# Altium schematic sheet ethernet.SchDoc
size A3; SheetNumber: 8; SheetTotal: 21
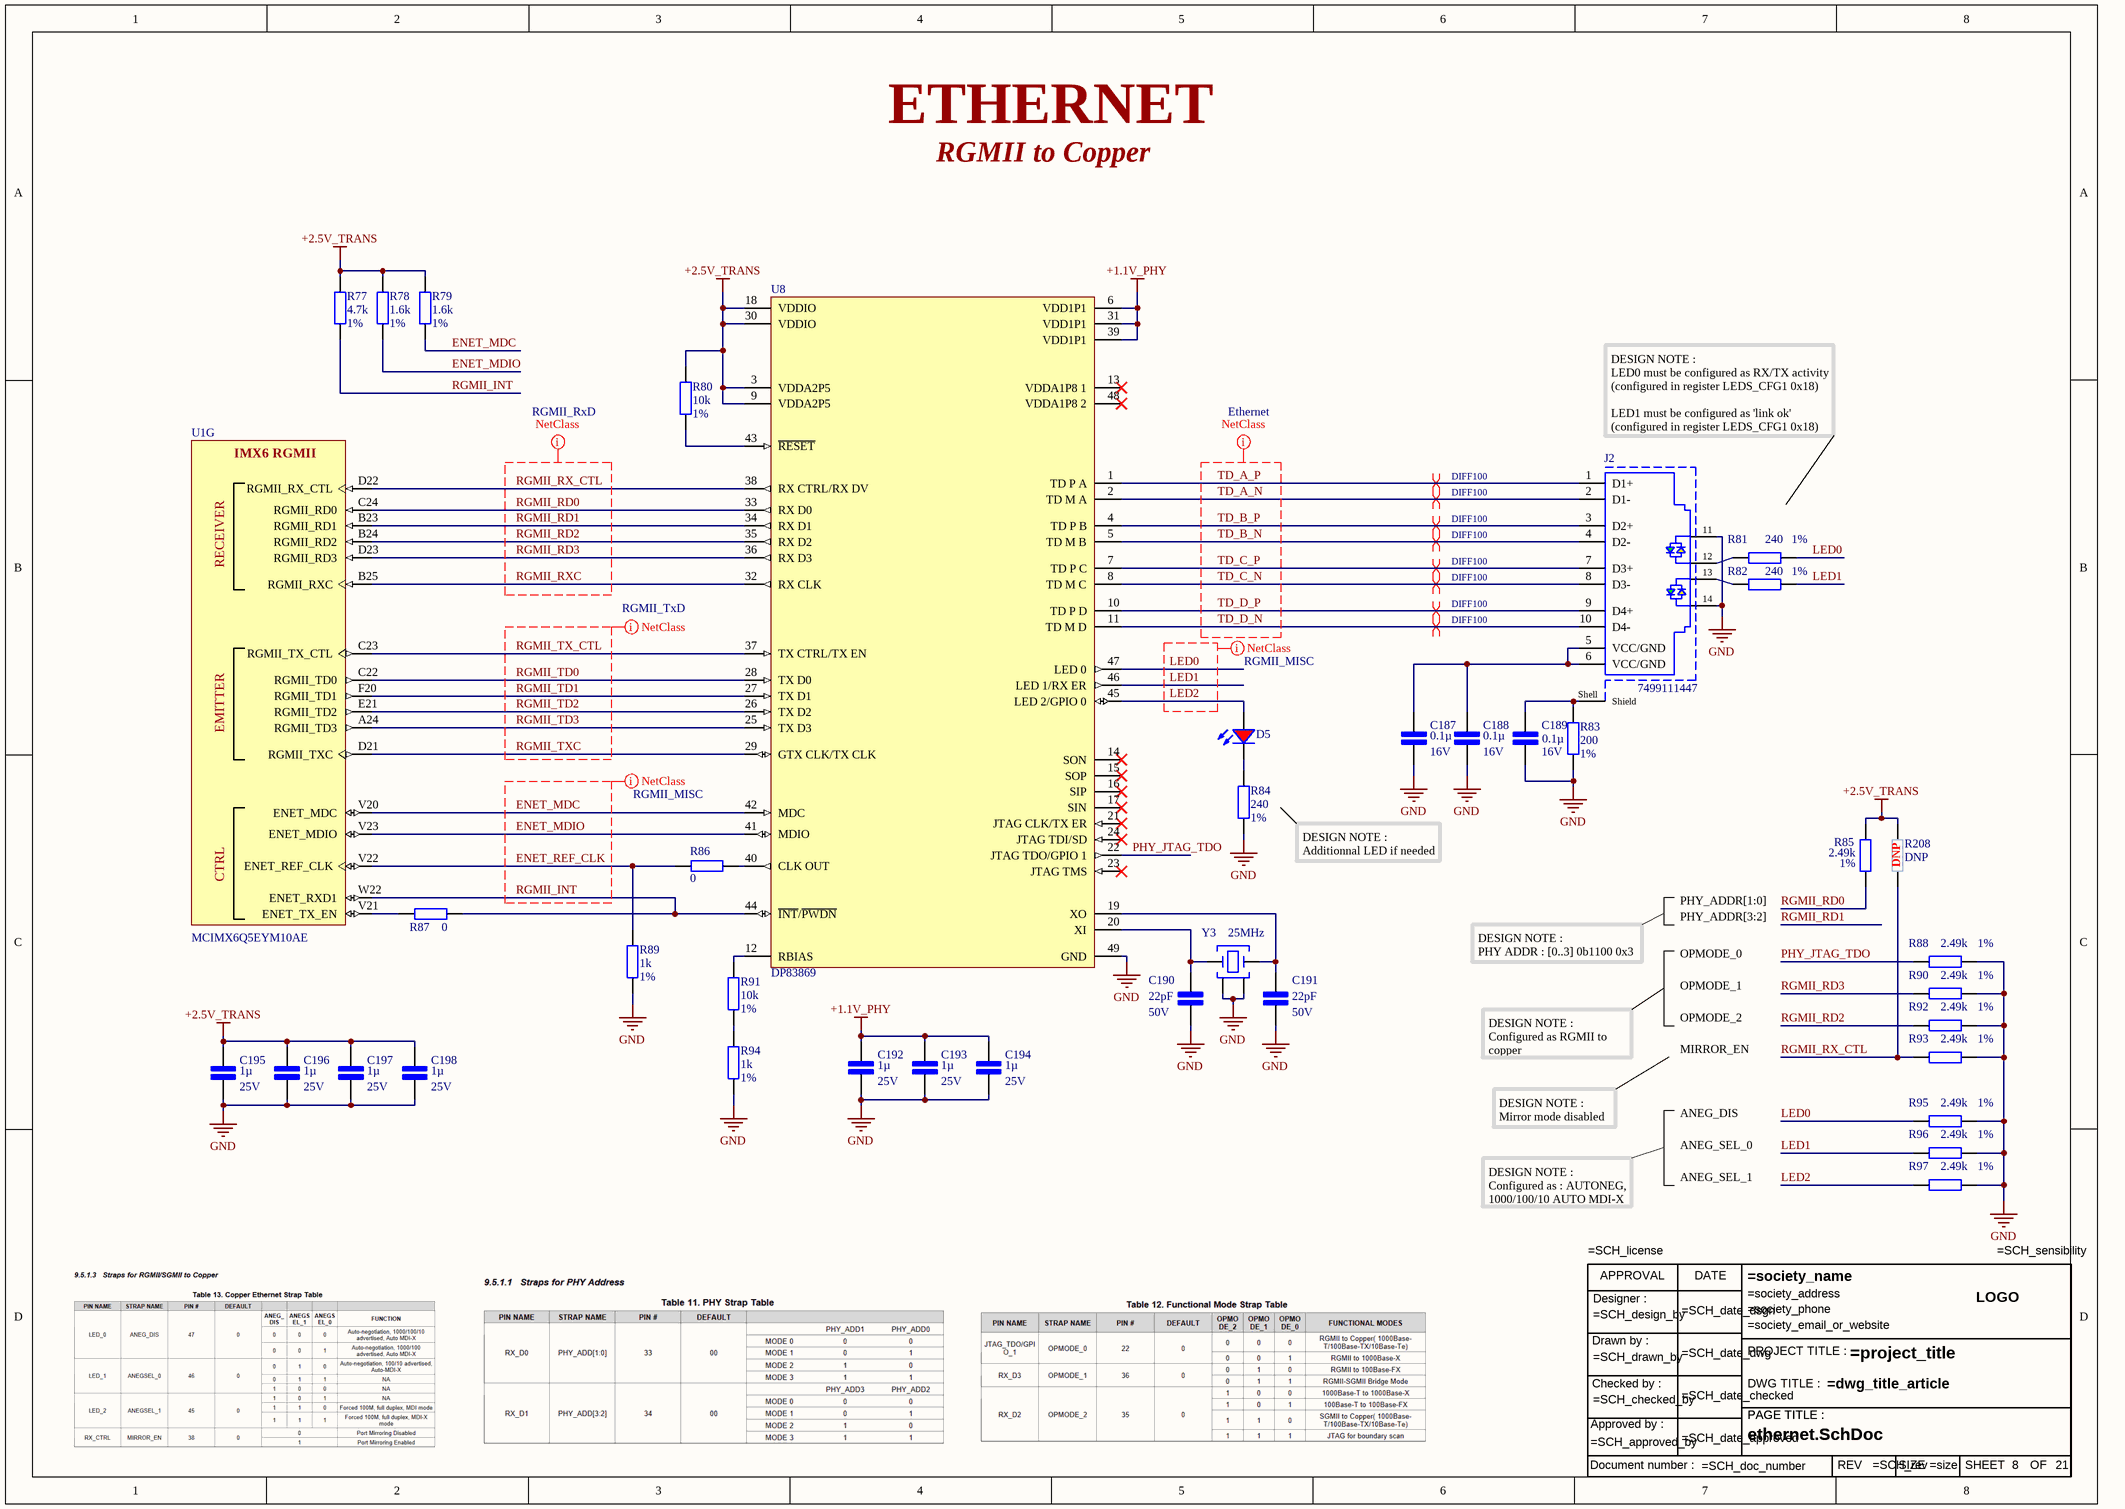
[diagram p0: ethernet.SchDoc]

## Parts
C187  0.1µ  Tension du diélectrique: 16V  [Cap cer 0402/1005]
C188  0.1µ  Tension du diélectrique: 16V  [Cap cer 0402/1005]
C189  0.1µ  Tension du diélectrique: 16V  [Cap cer 0402/1005]
C190  22pF  Tension du diélectrique: 50V  [Cap cer 0402/1005]
C191  22pF  Tension du diélectrique: 50V  [Cap cer 0402/1005]
C192  1µ  Tension du diélectrique: 25V  [Cap cer 0402/1005]
C193  1µ  Tension du diélectrique: 25V  [Cap cer 0402/1005]
C194  1µ  Tension du diélectrique: 25V  [Cap cer 0402/1005]
C195  1µ  Tension du diélectrique: 25V  [Cap cer 0402/1005]
C196  1µ  Tension du diélectrique: 25V  [Cap cer 0402/1005]
C197  1µ  Tension du diélectrique: 25V  [Cap cer 0402/1005]
C198  1µ  Tension du diélectrique: 25V  [Cap cer 0402/1005]
D5  Red, 2V, 120deg  [LED red 0603]  (value not drawn)
J2  7499111447  [RJ45 7499111447]
R77  4.7k  pourcentage: 1%  [Res 0402/1005]
R78  1.6k  pourcentage: 1%  [Res 0402/1005]
R79  1.6k  pourcentage: 1%  [Res 0402/1005]
R80  10k  pourcentage: 1%  [Res 0402/1005]
R81  240  pourcentage: 1%  [Res 0402/1005]
R82  240  pourcentage: 1%  [Res 0402/1005]
R83  200  pourcentage: 1%  [Res 0402/1005]
R84  240  pourcentage: 1%  [Res 0402/1005]
R85  2.49k  pourcentage: 1%  [Res 0402/1005]
R86  0  [Res 0402/1005]
R87  0  [Res 0402/1005]
R88  2.49k  pourcentage: 1%  [Res 0402/1005]
R89  1k  pourcentage: 1%  [Res 0402/1005]
R90  2.49k  pourcentage: 1%  [Res 0402/1005]
R91  10k  pourcentage: 1%  [Res 0402/1005]
R92  2.49k  pourcentage: 1%  [Res 0402/1005]
R93  2.49k  pourcentage: 1%  [Res 0402/1005]
R94  1k  pourcentage: 1%  [Res 0402/1005]
R95  2.49k  pourcentage: 1%  [Res 0402/1005]
R96  2.49k  pourcentage: 1%  [Res 0402/1005]
R97  2.49k  pourcentage: 1%  [Res 0402/1005]
R208  DNP  [Res 0402/1005]
TB7  Title bloc ANSI modified  (value not drawn)
U1  MCIMX6Q5EYM10AE  [FRES-2197-01]  (part G of 21)
U8  DP83869  [QFN48]
Y3  25MHz  [IQXC-42]

## Nets
+1.1V_PHY: C192.1 C193.1 C194.1 U8.6(VDD1P1) U8.31(VDD1P1) U8.39(VDD1P1)
+2.5V_TRANS: C195.1 C196.1 C197.1 C198.1 R77.2 R78.2 R79.2 R80.2 R85.2 R208.2 U8.3(VDDA2P5) U8.9(VDDA2P5) U8.18(VDDIO) U8.30(VDDIO)
GND: C187.2 C188.2 C189.2 C190.2 C191.2 C192.2 C193.2 C194.2 C195.2 C196.2 C197.2 C198.2 J2.11 J2.14 R83.1 R84.1 R88.1 R89.1 R90.1 R92.1 R93.1 R94.1 R95.1 R96.1 R97.1 U8.49(GND) Y3.2(GND) Y3.4(GND)
ENET_MDC: R79.1 U1.V20(ENET_MDC) U8.42(MDC)
ENET_MDIO: R78.1 U1.V23(ENET_MDIO) U8.41(MDIO)
ENET_REF_CLK: R86.1 R89.2 U1.V22(ENET_REF_CLK)
LED0: R81.2 R95.2 U8.47(LED_0)
LED1: R82.2 R96.2 U8.46(LED_1/RX_ER)
LED2: D5.2(A) R97.2 U8.45(LED_2/GPIO_0)
PHY_JTAG_TDO: R88.2 U8.22(JTAG_TDO/GPIO_1)
RGMII_INT: R77.1 R87.2 U1.W22(ENET_RXD1) U8.44(~{INT}/~{PWDN})
RGMII_RD0: R85.1 U1.C24(RGMII_RD0) U8.33(RX_D0)
RGMII_RD1: U1.B23(RGMII_RD1) U8.34(RX_D1)
RGMII_RD2: R92.2 U1.B24(RGMII_RD2) U8.35(RX_D2)
RGMII_RD3: R90.2 U1.D23(RGMII_RD3) U8.36(RX_D3)
RGMII_RX_CTL: R93.2 R208.1 U1.D22(RGMII_RX_CTL) U8.38(RX_CTRL/RX_DV)
RGMII_RXC: U1.B25(RGMII_RXC) U8.32(RX_CLK)
RGMII_TD0: U1.C22(RGMII_TD0) U8.28(TX_D0)
RGMII_TD1: U1.F20(RGMII_TD1) U8.27(TX_D1)
RGMII_TD2: U1.E21(RGMII_TD2) U8.26(TX_D2)
RGMII_TD3: U1.A24(RGMII_TD3) U8.25(TX_D3)
RGMII_TX_CTL: U1.C23(RGMII_TX_CTL) U8.37(TX_CTRL/TX_EN)
RGMII_TXC: U1.D21(RGMII_TXC) U8.29(GTX_CLK/TX_CLK)
TD_A_N: J2.2(D1-) U8.2(TD_M_A)
TD_A_P: J2.1(D1+) U8.1(TD_P_A)
TD_B_N: J2.4(D2-) U8.5(TD_M_B)
TD_B_P: J2.3(D2+) U8.4(TD_P_B)
TD_C_N: J2.8(D3-) U8.8(TD_M_C)
TD_C_P: J2.7(D3+) U8.7(TD_P_C)
TD_D_N: J2.10(D4-) U8.11(TD_M_D)
TD_D_P: J2.9(D4+) U8.10(TD_P_D)
NetC187_1: C187.1 C188.1 J2.5(VCC/GND) J2.6(VCC/GND)
NetC189_1: C189.1 J2.Shell(Shield) R83.2
NetC190_1: C190.1 U8.20(XI) Y3.1(Crystal)
NetC191_1: C191.1 U8.19(XO) Y3.3(Crystal)
NetD5_1: D5.1(K) R84.2
NetJ2_12: J2.12 R81.1
NetJ2_13: J2.13 R82.1
NetR80_1: R80.1 U8.43(~{RESET})
NetR86_2: R86.2 U8.40(CLK_OUT)
NetR87_1: R87.1 U1.V21(ENET_TX_EN)
NetR91_1: R91.1 R94.2
NetR91_2: R91.2 U8.12(RBIAS)

Not connected (* = marked no-connect by the designer): U8 13(VDDA1P8_1)* 14(SON)* 15(SOP)* 16(SIP)* 17(SIN)* 21(JTAG_CLK/TX_ER)* 23(JTAG_TMS)* 24(JTAG_TDI/SD)* 48(VDDA1P8_2)*

## Layout directives
net class Ethernet: TD_A_N, TD_A_P, TD_B_N, TD_B_P, TD_C_N, TD_C_P, TD_D_N, TD_D_P
net class RGMII_RxD: RGMII_RD0, RGMII_RD1, RGMII_RD2, RGMII_RD3, RGMII_RX_CTL, RGMII_RXC
differential pair; differential pair class DIFF100: TD_A_N, TD_A_P, TD_B_N, TD_B_P, TD_C_N, TD_C_P, TD_D_N, TD_D_P
net class RGMII_TxD: RGMII_TD0, RGMII_TD1, RGMII_TD2, RGMII_TD3, RGMII_TX_CTL, RGMII_TXC
net class RGMII_MISC: ENET_MDC, ENET_MDIO, ENET_REF_CLK, LED0, LED1, LED2, RGMII_INT

## Notes on the sheet
- ETHERNET
- RGMII to Copper
- (near J2) DESIGN NOTE :
  LED0 must be configured as RX/TX activity (configured in register LEDS_CFG1 0x18)
  LED1 must be configured as 'link ok' (configured in register LEDS_CFG1 0x18)
- DESIGN NOTE :
  Additionnal LED if needed
- PHY_ADDR[1:0]
- PHY_ADDR[3:2]
- DESIGN NOTE :
  PHY ADDR : [0..3] 0b1100 0x3
- OPMODE_0
- OPMODE_1
- DESIGN NOTE :
  Configured as RGMII to copper
- OPMODE_2
- MIRROR_EN
- DESIGN NOTE :
  Mirror mode disabled
- ANEG_DIS
- ANEG_SEL_0
- ANEG_SEL_1
- DESIGN NOTE :
  Configured as : AUTONEG, 1000/100/10 AUTO MDI-X
- (in symbol IMX6Q5EYM10AE, part G) IMX6 RGMII; RECEIVER; EMITTER; CTRL
- (in symbol Title bloc ANSI) APPROVAL; DATE; Designer :; LOGO; Drawn by :; PROJECT TITLE :; Checked by :; DWG TITLE :; PAGE TITLE :; Approved by :; Document number :; REV; SIZE; SHEET; OF

## Library data of the parts
C187-C189 = cap 0.1µ 16V: cap solid electrolyte 0.1µ 6.3V 10%; Diélectrique: X7R
C190 C191 = cap 22pF 50V: cap cer 22pF 50V 5% NP0 0402; Diélectrique: NP0
C192-C198 = cap 1µ 25V: cap cer 1µ 25V 10% X5R 0402; Diélectrique: X5R
D5 = LED Red 0603: WL-SMCC SMD Mono-color Chip LED Compact, size 0603, Red, 2V, 120deg 150060RS73220; Dominant Wavelength: 624nm; Luminous Intensity: 90mcd; Peak Wavelength: 632nm; Chip Technology: AlInGaP; ComponentLink1URL: http://www.we-online.de; ComponentLink2Description: Datasheet; ComponentLink2URL: https://katalog.we-online.com/led/datasheet/150060RS73220.pdf; Part Number: 150060RS73220; Published Date: July 2019; Publisher: Wurth Elektronik; Size: 0603; Viewing Angle: 120deg; Packaging: Tape and Reel; Emitting Color: Red; Mounting Technology: SMT; Forward Voltage: 2V; Operating Temperature: -40 to +85degC
J2 = RJ45 7499111447
R77 = res 4.7k 1%: res 4.7k 1% 0402
R78 R79 = res 1.6k 1%: res 1.6k 1% 0402
R80 R91 = res 10k 1%: res 10k 1% 0402
R81 R82 R84 = res 240 1%: res 240 1% 0402
R83 = res 200 1%: res 200 1% 0402
R85 R88 R90 R92 R93 R95-R97 = res 2.49k 1%: res 2.49k 1% 0402
R86 R87 = res 0Ohm small: res 0402; pourcentage: --
R89 R94 = res 1k 1%: res 1k 1% 0402
R208 = res DNP 0402: res DNP 0403; pourcentage: 1%
TB7 = Title bloc ANSI
U1 = IMX6Q5EYM10AE: 32-Bit i.MX 6 Quad Application Processor, 1 GHz, 256 KB RAM, Extended Consumer Grade, 624-Pin FCPBGA, RoHS, Tape and Reel; PartNumber: MCIMX6Q5EYM10ACR; Manufacturer: Freescale Semiconductor; CAN: FlexCAN; Number of Cores: 4 Spec; External Memory Supported: DDR3, DDR3L, FLASH, LPDDR2; Speed Grade: 1 GHz; Core Type: ARM Cortex A9; Cache (KB): 32; Ethernet: 1 Gbps + IEEE 1588; Internal RAM (KB): 256; ComponentLink1Description: Manufacturer URL; ComponentLink2Description: Datasheet; DatasheetVersion: Rev. 2.3; ComponentLink3URL: http://cache.freescale.com/files/32bit/doc/data_sheet/IMX6DQCEC.pdf?fpsp=1&WT_TYPE=Data%20Sheets&WT_VENDOR=FREESCALE&WT_FILE_FORMAT=pdf&WT_ASSET=Documentation; ComponentLink1URL: http://www.freescale.com/; Packing: Tape and Reel; Temperature Range: -20 to 105 degC; ComponentLink2URL: http://cache.freescale.com/files/32bit/doc/data_sheet/IMX6DQCEC.pdf?fpsp=1&WT_TYPE=Data%20Sheets&WT_VENDOR=FREESCALE&WT_FILE_FORMAT=pdf&WT_ASSET=Documentation; ComponentLink3Description: Package Specification; PackageVersion: Rev. A; RoHS: TRUE; Quad/Dual CPU: i.MX 6Quad; Mounting Technology: Surface Mount; PackageReference: FCPBGA-624; PackageDescription: 624-pin Ball Grid Array Package, Body 21 x 21mm, Pitch 0.8mm
U8 = IC DP83869: Ethernet transciever
Y3 = XTAL 25MHz: WE-XTAL, 25MHz, +/-10ppm; Manufacturer Part Number: 830108212509; Manufacturer: Wurth Elektronik; Frequency: 24MHz; Load Capacitance: 10pF; Operating Temperature: -20 to +70degC; Packaging: Tape and Reel; Published Date: July 2020; Frequency Stability: +/-10ppm; Frequency Tolerance: +/-10ppm; Mounting Technology: SMT